# EAGLE design ECE411_G16_V8 (EAGLE 9.2.1)
Version 6: Added bypass capacitors to uC +Vcc, added test points for I2C.
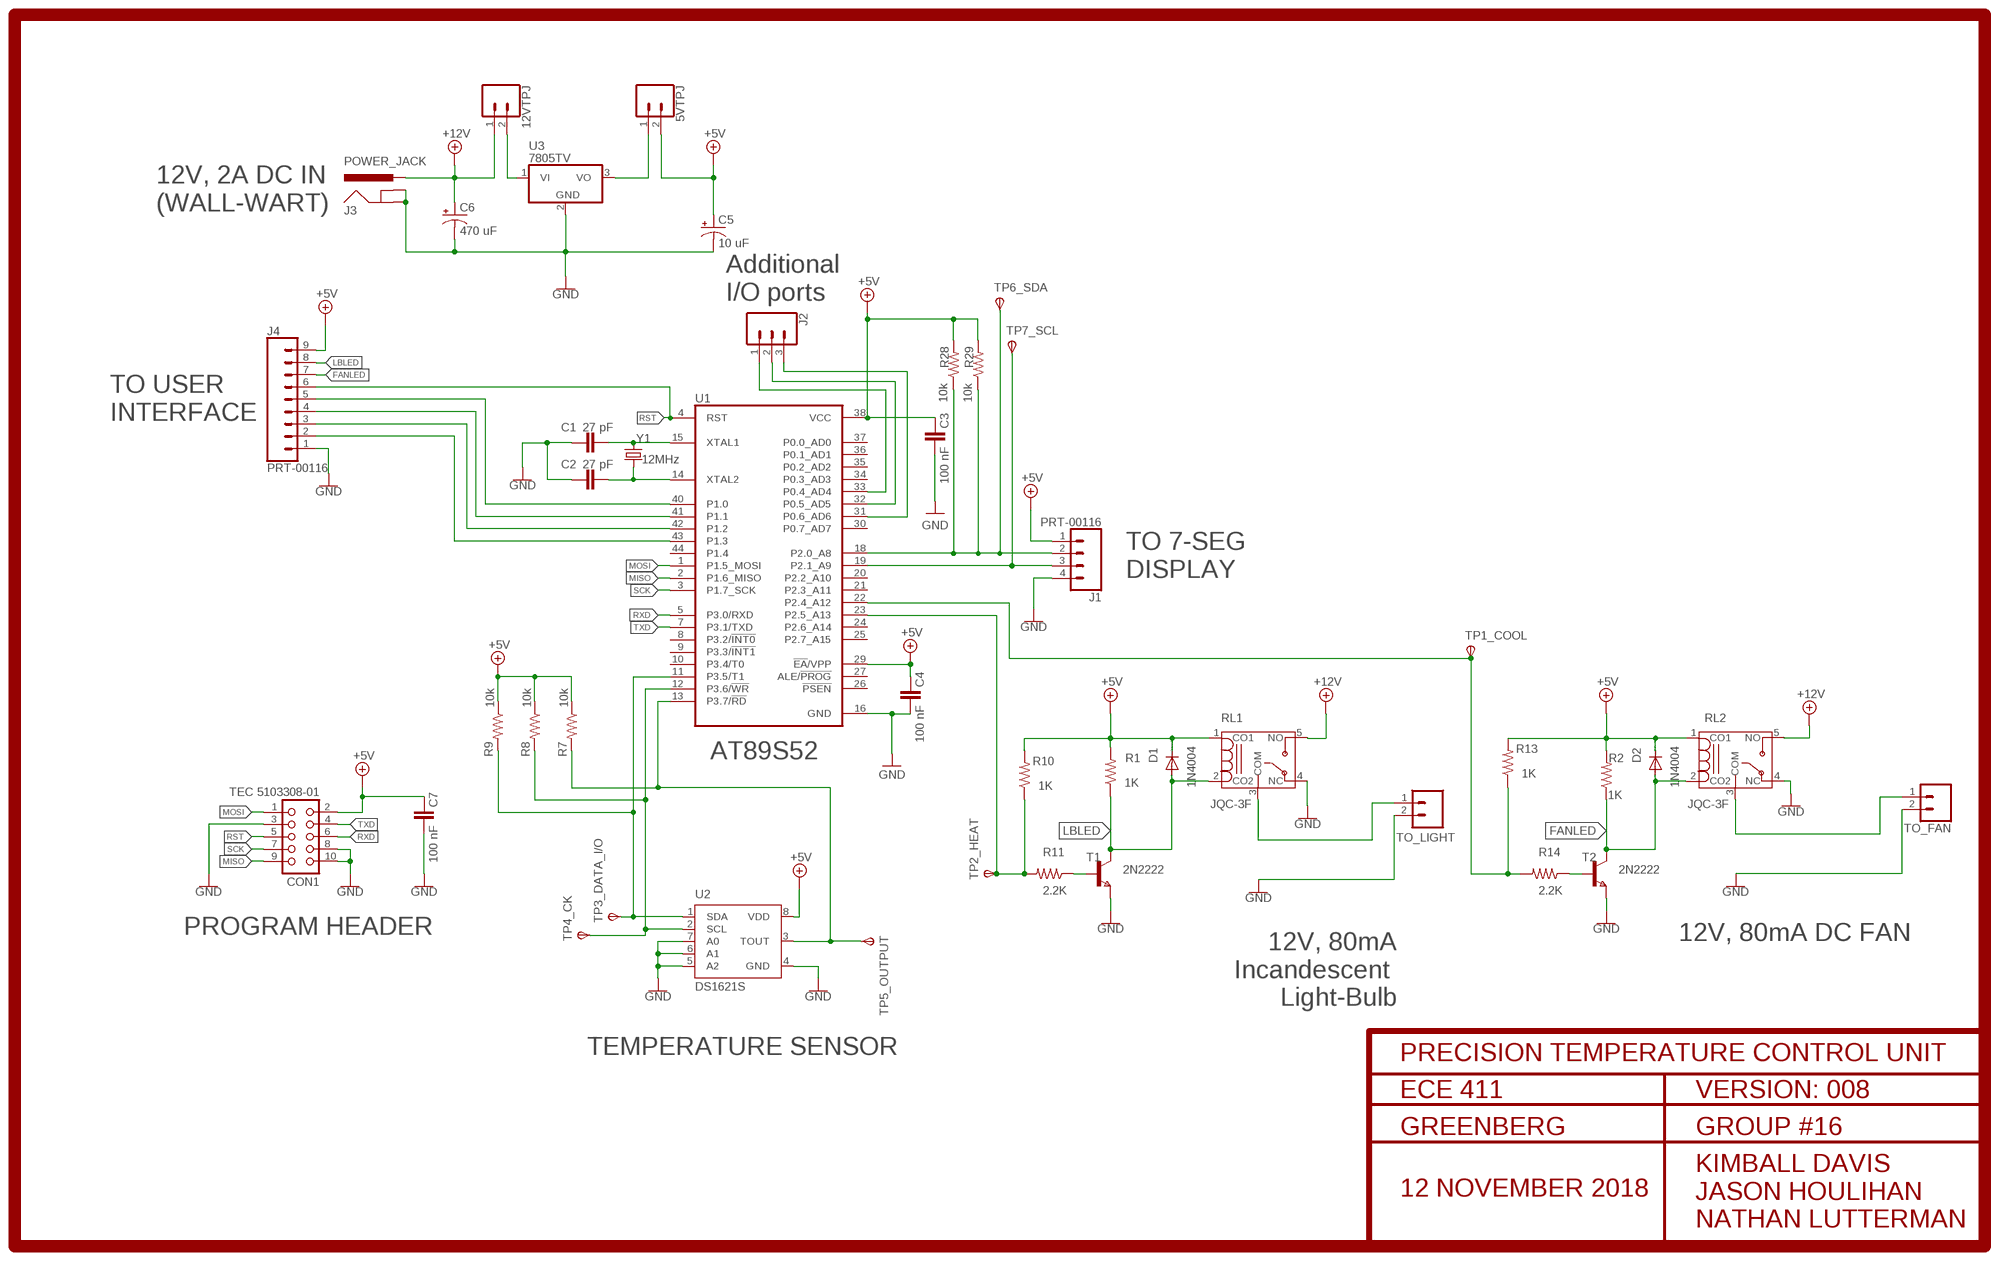
[diagram p0: schematic, sheet 1]

## Parts
5VTPJ  CONN_02  [1X02]
12VTPJ  CONN_02  [1X02]
C1  27 pF  CAPACITOR_0603_M  [RESC0603_M]
C2  27 pF  CAPACITOR_0603_M  [RESC0603_M]
C3  100 nF  CAPACITOR_0603_M  [RESC0603_M]
C4  100 nF  CAPACITOR_0603_M  [RESC0603_M]
C5  10 uF  CPOL-USTT2D6  [TT2D6]
C6  470 uF  CPOL-USTT5D11  [TT5D11]
C7  100 nF  CAPACITOR_0603_M  [RESC0603_M]
CON1  TEC 5103308-01  CON10  [CON10]
D1  1N4004  [DO41-10]
D2  1N4004  [DO41-10]
J1  PRT-00116  CONN_04  [1X04]
J2  CONN_03  [1X03]
J3  POWER_JACK  [POWER_JACK_PTH]
J4  PRT-00116  CONN_09  [1X09]
R1  1K  R-US_R0603  [R0603]
R2  1K  R-US_R0603  [R0603]
R7  10k  R-US_R0603  [R0603]
R8  10k  R-US_R0603  [R0603]
R9  10k  R-US_R0603  [R0603]
R10  1K  R-US_R0603  [R0603]
R11  2.2K  R-US_R0603  [R0603]
R13  1K  R-US_R0603  [R0603]
R14  2.2K  R-US_R0603  [R0603]
R28  10k  R-US_R0603  [R0603]
R29  10k  R-US_R0603  [R0603]
RL1  JQC-3F  [T073]
RL2  JQC-3F  [T073]
T1  2N2222  NPNSOT23  [SOT-23]
T2  2N2222  NPNSOT23  [SOT-23]
TO_FAN  CONN_02  [1X02]
TO_LIGHT  CONN_02  [1X02]
TP1_COOL  TPSTP20SQ  [TP20SQ]
TP2_HEAT  TPSTP20SQ  [TP20SQ]
TP3_DATA_I/O  TPSTP20SQ  [TP20SQ]
TP4_CK  TPSTP20SQ  [TP20SQ]
TP5_OUTPUT  TPSTP20SQ  [TP20SQ]
TP6_SDA  TPSTP20SQ  [TP20SQ]
TP7_SCL  TPSTP20SQ  [TP20SQ]
U1  AT89S52  AT89S51-24P  [TQFP44]
U2  DS1621S  [SO08]
U3  7805TV  [TO220V]
Y1  12MHz  CRYSTAL-12MHZ"  [CRYSTAL-SMD-5X3.2-4PAD]

## Nets
+5V: 5VTPJ.2 C3.2 C4.2 C5.+ C7.2 CON1.2 D1.C D2.C J1.1 J4.9 R1.2 R2.2 R7.1 R8.1 R9.1 R10.2 R13.2 R28.2 R29.2 RL1.1(CO1) RL2.1(CO1) U1.29(!EA!/VPP) U1.38(VCC) U2.8(VDD)
+12V: 12VTPJ.1 C6.+ J3.PWR RL1.5(NO) RL2.5(NO)
FANLED: D2.A J4.7 R2.1 RL2.2(CO2) T2.1(C)
GND: C1.1 C2.1 C3.1 C4.1 C5.- C6.- C7.1 CON1.3 CON1.8 CON1.10 J1.4 J3.GND J3.GNDBREAK J4.1 RL1.4(NC) RL2.4(NC) T1.2(E) T2.2(E) TO_FAN.2 TO_LIGHT.2 U1.16(GND) U2.4(GND) U2.5(A2) U2.6(A1) U2.7(A0) U3.2(GND)
LBLED: D1.A J4.8 R1.1 RL1.2(CO2) T1.1(C)
MISO: CON1.9 U1.2(P1.6_MISO)
MOSI: CON1.1 U1.1(P1.5_MOSI)
N$1: C1.2 U1.15(XTAL1) Y1.1
N$2: C2.2 U1.14(XTAL2) Y1.3
N$3: J1.2 R28.1 R29.1 TP6_SDA.TP(PP) U1.18(P2.0_A8)
N$4: J1.3 TP7_SCL.TP(PP) U1.19(P2.1_A9)
N$5: 12VTPJ.2 U3.1(VI)
N$6: 5VTPJ.1 U3.3(VO)
N$7: RL2.3(COM) TO_FAN.1
N$8: RL1.3(COM) TO_LIGHT.1
N$9: R7.2 TP5_OUTPUT.TP(PP) U1.13(P3.7/!RD) U2.3(TOUT)
N$10: R8.2 TP4_CK.TP(PP) U1.12(P3.6/!WR) U2.2(SCL)
N$11: R9.2 TP3_DATA_I/O.TP(PP) U1.11(P3.5/T1) U2.1(SDA)
N$12: R10.1 R11.2 TP2_HEAT.TP(PP) U1.23(P2.5_A13)
N$13: R11.1 T1.3(B)
N$14: J2.1 U1.33(P0.4_AD4)
N$15: J2.2 U1.32(P0.5_AD5)
N$16: R13.1 R14.2 TP1_COOL.TP(PP) U1.22(P2.4_A12)
N$17: R14.1 T2.3(B)
N$18: J2.3 U1.31(P0.6_AD6)
N$34: J4.5 U1.40(P1.0)
N$35: J4.4 U1.41(P1.1)
N$36: J4.3 U1.42(P1.2)
N$37: J4.2 U1.43(P1.3)
RST: CON1.5 J4.6 U1.4(RST)
RXD: CON1.6 U1.5(P3.0/RXD)
SCK: CON1.7 U1.3(P1.7_SCK)
TXD: CON1.4 U1.7(P3.1/TXD)
Unconnected: U1.8(P3.2/!INT0) U1.9(P3.3/!INT1) U1.10(P3.4/T0) U1.20(P2.2_A10) U1.21(P2.3_A11) U1.24(P2.6_A14) U1.25(P2.7_A15) U1.26(!PSEN) U1.27(ALE/!PROG) U1.30(P0.7_AD7) U1.34(P0.3_AD3) U1.35(P0.2_AD2) U1.36(P0.1_AD1) U1.37(P0.0_AD0) U1.44(P1.4)

## Notes on the sheet
- 12V, 2A DC IN
  (WALL-WART)
- Additional
  I/O ports
- TO USER
  INTERFACE
- TO 7-SEG 
  DISPLAY
- AT89S52
- PROGRAM HEADER | 12V, 80mA DC FAN
- 12V, 80mA
  Incandescent 
  Light-Bulb
- TEMPERATURE SENSOR

## Power pins joined to a net without a drawn wire
GND: U1.17(GND)

## Library data of the parts
5VTPJ 12VTPJ TO_FAN TO_LIGHT = SparkFun-Connectors:CONN_02: Multi connection point. Often used as Generic Header-pin footprint for 0.1 inch spaced/style header connections On any of the 0.1 inch spaced packages, you can populate with these: Break Away Headers - Straight <https://www.sparkfun.com/products/116> (PRT-00116) Break Away Male Headers - Right Angle <https://www.sparkfun.com/products/553> (PRT-00553) Female Headers <https://www.sparkfun.com/products/115> (PRT-00115) Break Away Headers - Machine Pin <https://www.sparkfun.com/products/117> (PRT-00117) Break Away Female Headers - Swiss Machine Pin <https://www.sparkfun.com/products/743> (PRT-00743) For SCREWTERMINALS and SPRING TERMINALS visit here: Screw Terimnals on SparkFun.com <https://www.sparkfun.com/search/results?term=Screw+Terminals> (5mm/3.5mm/2.54mm spacing) This device is also useful as a general connection point to wire up your design to another part of your project. Our various solder wires solder well into these plated through hole pads. Hook-Up Wire - Assortment (Stranded, 22 AWG) <https://www.sparkfun.com/products/11375> (PRT-11375) Hook-Up Wire - Assortment (Solid Core, 22 AWG) <https://www.sparkfun.com/products/11367> (PRT-11367) View the entire wire category on our website here <https://www.sparkfun.com/categories/141> Special notes: Molex polarized connector foot print use with: PRT-08233 with associated crimp pins and housings. 2.54_SCREWTERM for use with PRT-10571. 3.5mm Screw Terminal footprints for PRT-08084 5mm Screw Terminal footprints for use with PRT-08432
C1-C4 C7 = Nordic_nRF:CAPACITOR: Generic chip capacitor
C5 C6 = rcl:CPOL-US: POLARIZED CAPACITOR, American symbol; SPICEPREFIX: C
CON1 = con-harting:CON10: CONNECTOR; OC_FARNELL: unknown; OC_NEWARK: unknown
D1 D2 = diode:1N4004: DIODE general purpose rectifier, 1 A
J1 = SparkFun-Connectors:CONN_04: Multi connection point. Often used as Generic Header-pin footprint for 0.1 inch spaced/style header connections On any of the 0.1 inch spaced packages, you can populate with these: Break Away Headers - Straight <https://www.sparkfun.com/products/116> (PRT-00116) Break Away Male Headers - Right Angle <https://www.sparkfun.com/products/553> (PRT-00553) Female Headers <https://www.sparkfun.com/products/115> (PRT-00115) Break Away Headers - Machine Pin <https://www.sparkfun.com/products/117> (PRT-00117) Break Away Female Headers - Swiss Machine Pin <https://www.sparkfun.com/products/743> (PRT-00743) For SCREWTERMINALS and SPRING TERMINALS visit here: Screw Terimnals on SparkFun.com <https://www.sparkfun.com/search/results?term=Screw+Terminals> (5mm/3.5mm/2.54mm spacing) This device is also useful as a general connection point to wire up your design to another part of your project. Our various solder wires solder well into these plated through hole pads. Hook-Up Wire - Assortment (Stranded, 22 AWG) <https://www.sparkfun.com/products/11375> (PRT-11375) Hook-Up Wire - Assortment (Solid Core, 22 AWG) <https://www.sparkfun.com/products/11367> (PRT-11367) View the entire wire category on our website here <https://www.sparkfun.com/categories/141> Special notes: Molex polarized connector foot print use with SKU : PRT-08231 with associated crimp pins and housings. 1MM SMD Version SKU: PRT-10208; PROD_ID: CONN-09696
J2 = SparkFun-Connectors:CONN_03: Multi connection point. Often used as Generic Header-pin footprint for 0.1 inch spaced/style header connections On any of the 0.1 inch spaced packages, you can populate with these: Break Away Headers - Straight <https://www.sparkfun.com/products/116> (PRT-00116) Break Away Male Headers - Right Angle <https://www.sparkfun.com/products/553> (PRT-00553) Female Headers <https://www.sparkfun.com/products/115> (PRT-00115) Break Away Headers - Machine Pin <https://www.sparkfun.com/products/117> (PRT-00117) Break Away Female Headers - Swiss Machine Pin <https://www.sparkfun.com/products/743> (PRT-00743) Stackable Header - 3 Pin (Female, 0.1") <https://www.sparkfun.com/products/13875> (PRT-13875) For SCREWTERMINALS and SPRING TERMINALS visit here: Screw Terimnals on SparkFun.com <https://www.sparkfun.com/search/results?term=Screw+Terminals> (5mm/3.5mm/2.54mm spacing) This device is also useful as a general connection point to wire up your design to another part of your project. Our various solder wires solder well into these plated through hole pads. Hook-Up Wire - Assortment (Stranded, 22 AWG) <https://www.sparkfun.com/products/11375> (PRT-11375) Hook-Up Wire - Assortment (Solid Core, 22 AWG) <https://www.sparkfun.com/products/11367> (PRT-11367) View the entire wire category on our website here <https://www.sparkfun.com/categories/141> Special notes: Molex polarized connector foot print use with SKU : PRT-08232 with associated crimp pins and housings.
J3 = SparkFun-Connectors:POWER_JACK: Power Jack Connector This is the standard 5.5mm barrel jack for power. The PTH is the most common, proven, reliable, footprint. The Slot footprint only works if the mill layer is transmitted to the PCB fab house so be warned. Here are the connectors we sell at SparkFun: DC Barrel Power Jack/Connector <https://www.sparkfun.com/products/119> (PRT-00119) DC Barrel Power Jack/Connector (SMD) <https://www.sparkfun.com/products/12748> (PRT-12748) DC Barrel Jack Adapter - Breadboard Compatible <https://www.sparkfun.com/products/10811> (PRT-10811) It is used on this SparkFun product (and many, many others): SparkFun RedBoard - Programmed with Arduino <https://www.sparkfun.com/products/12757> (DEV-12757) Also, if you need a mating power supply or connector, please check these out: Wall Adapter Power Supply - 9VDC 650mA <https://www.sparkfun.com/products/298> (TOL-00298) DC Barrel Jack Adapter - Male <https://www.sparkfun.com/products/10287> (PRT-10287); PROD_ID: CONN-08197
J4 = SparkFun-Connectors:CONN_09: Multi connection point. Often used as Generic Header-pin footprint for 0.1 inch spaced/style header connections On any of the 0.1 inch spaced packages, you can populate with these: Break Away Headers - Straight <https://www.sparkfun.com/products/116> (PRT-00116) Break Away Male Headers - Right Angle <https://www.sparkfun.com/products/553> (PRT-00553) Female Headers <https://www.sparkfun.com/products/115> (PRT-00115) Break Away Headers - Machine Pin <https://www.sparkfun.com/products/117> (PRT-00117) Break Away Female Headers - Swiss Machine Pin <https://www.sparkfun.com/products/743> (PRT-00743) For SCREWTERMINALS and SPRING TERMINALS visit here: Screw Terimnals on SparkFun.com <https://www.sparkfun.com/search/results?term=Screw+Terminals> (5mm/3.5mm/2.54mm spacing) This device is also useful as a general connection point to wire up your design to another part of your project. Our various solder wires solder well into these plated through hole pads. Hook-Up Wire - Assortment (Stranded, 22 AWG) <https://www.sparkfun.com/products/11375> (PRT-11375) Hook-Up Wire - Assortment (Solid Core, 22 AWG) <https://www.sparkfun.com/products/11367> (PRT-11367) View the entire wire category on our website here <https://www.sparkfun.com/categories/141> Special notes: Molex polarized connector foot print use with SKU : PRT-08231 with associated crimp pins and housings. 1MM SMD Version SKU: PRT-10208 NOTES ON THE VARIANTS LOCK and LOCK_LONGPADS... This footprint was designed to help hold the alignment of a through-hole component (i.e. 6-pin header) while soldering it into place. You may notice that each hole has been shifted either up or down by 0.005 of an inch from it's more standard position (which is a perfectly straight line). This slight alteration caused the pins (the squares in the middle) to touch the edges of the holes. Because they are alternating, it causes a "brace" to hold the component in place. 0.005 has proven to be the perfect amount of "off-center" position when using our standard breakaway headers. Although looks a little odd when you look at the bare footprint, once you have a header in there, the alteration is very hard to notice. Also,if you push a header all the way into place, it is covered up entirely on the bottom side.
R1 R2 R7-R11 R13 R14 R28 R29 = audio amplifier example:R-US_: RESISTOR, American symbol
RL1 RL2 = JQC-3F:JQC-3F
T1 T2 = zetex:NPNSOT23: NPN TRANSISTOR; MPN: DSS20201L-7; OC_FARNELL: 1710688; OC_NEWARK: 25R4555
TP1_COOL TP2_HEAT TP3_DATA_I/O TP4_CK TP5_OUTPUT TP6_SDA TP7_SCL = testpad:TPS: TEST PIN
U1 = atmel:AT89S51*P: 8-bit Microcontroller with 4K BytesIn-System Programmable Flash Source: http://www.atmel.com/dyn/resources/prod_documents/doc2487.pdf; OC_FARNELL: unknown; OC_NEWARK: unknown
U2 = maxim:DS1621: Digital Thermometer and Thermostat Source: http://pdfserv.maxim-ic.com/en/ds/DS1621.pdf; MF: DALLAS SEMICONDUCTOR; MPN: DS1621S+; OC_FARNELL: 9725261; OC_NEWARK: 23K3501
U3 = linear:78*: Positive VOLTAGE REGULATOR Source: http://cache.national.com/ds/LM/LM78L05.pdf http://www.fairchildsemi.com/ds/LM/LM7805.pdf
Y1 = SparkFun-Clocks:CRYSTAL-12MHZ: 12.0MHz Crystal Frequency: 12.0MHz Frequency Tolerance: ±20ppm Load Capacitance: 18pF SparkFun Products: SparkFun Logomatic <https://www.sparkfun.com/products/12772> Pocket AVR Programmer <https://www.sparkfun.com/products/9825>; PROD_ID: XTAL-08297

## Board
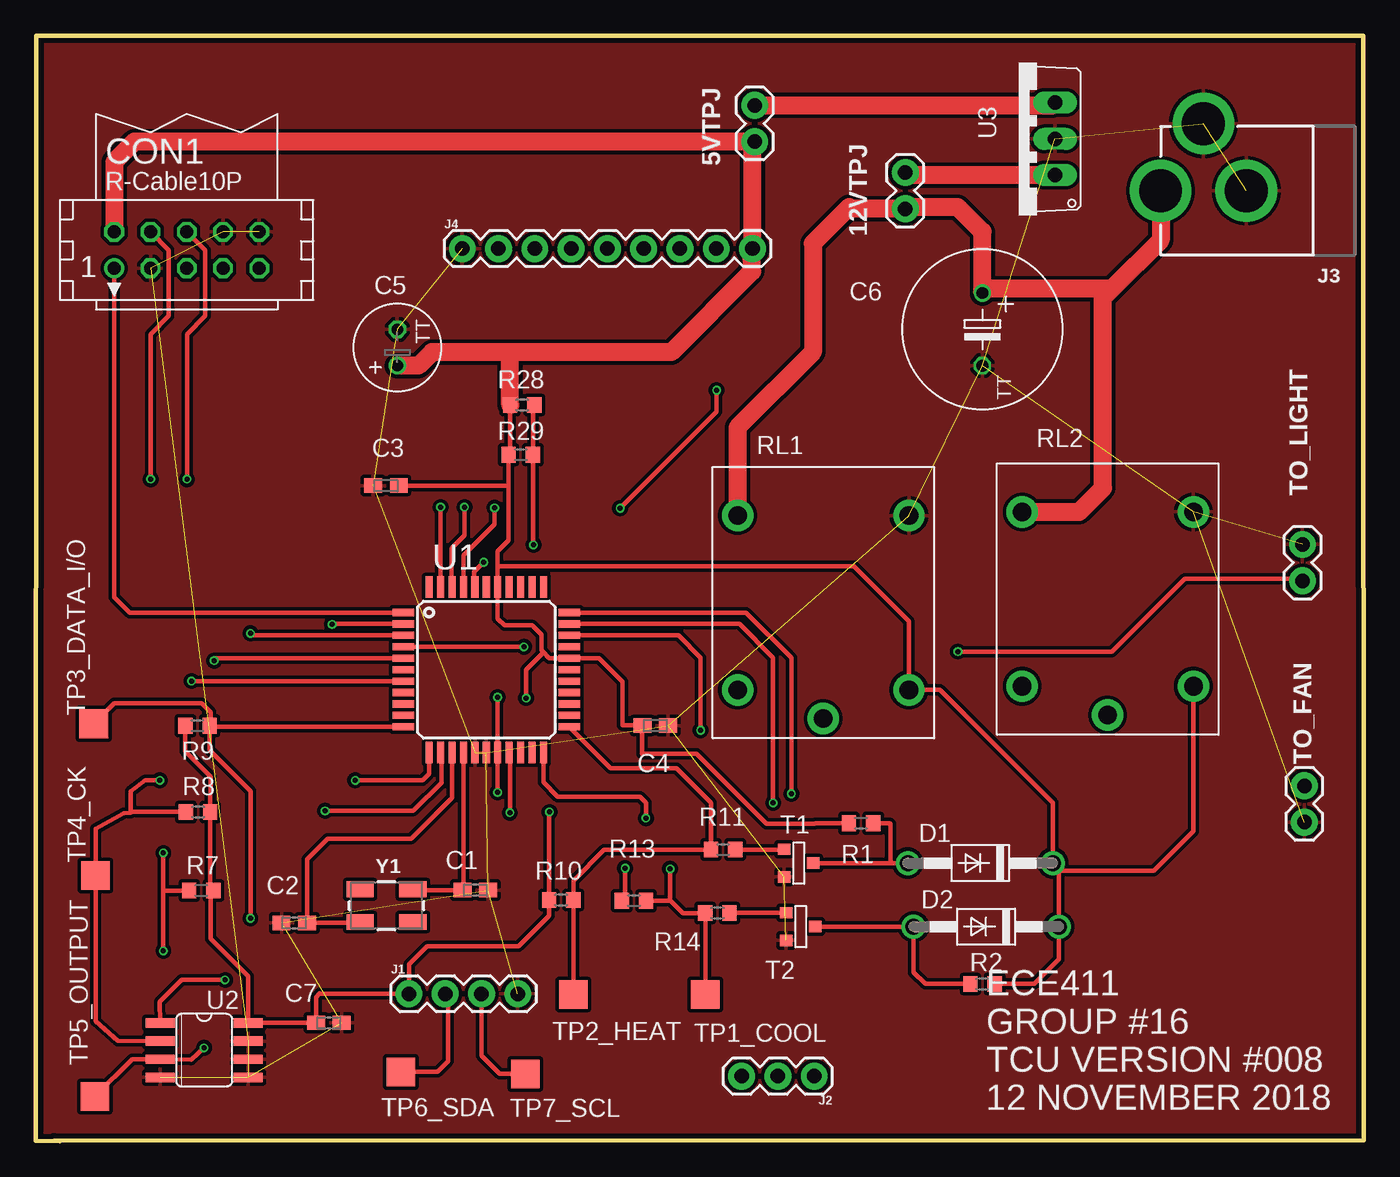
[diagram p1: board, top side]
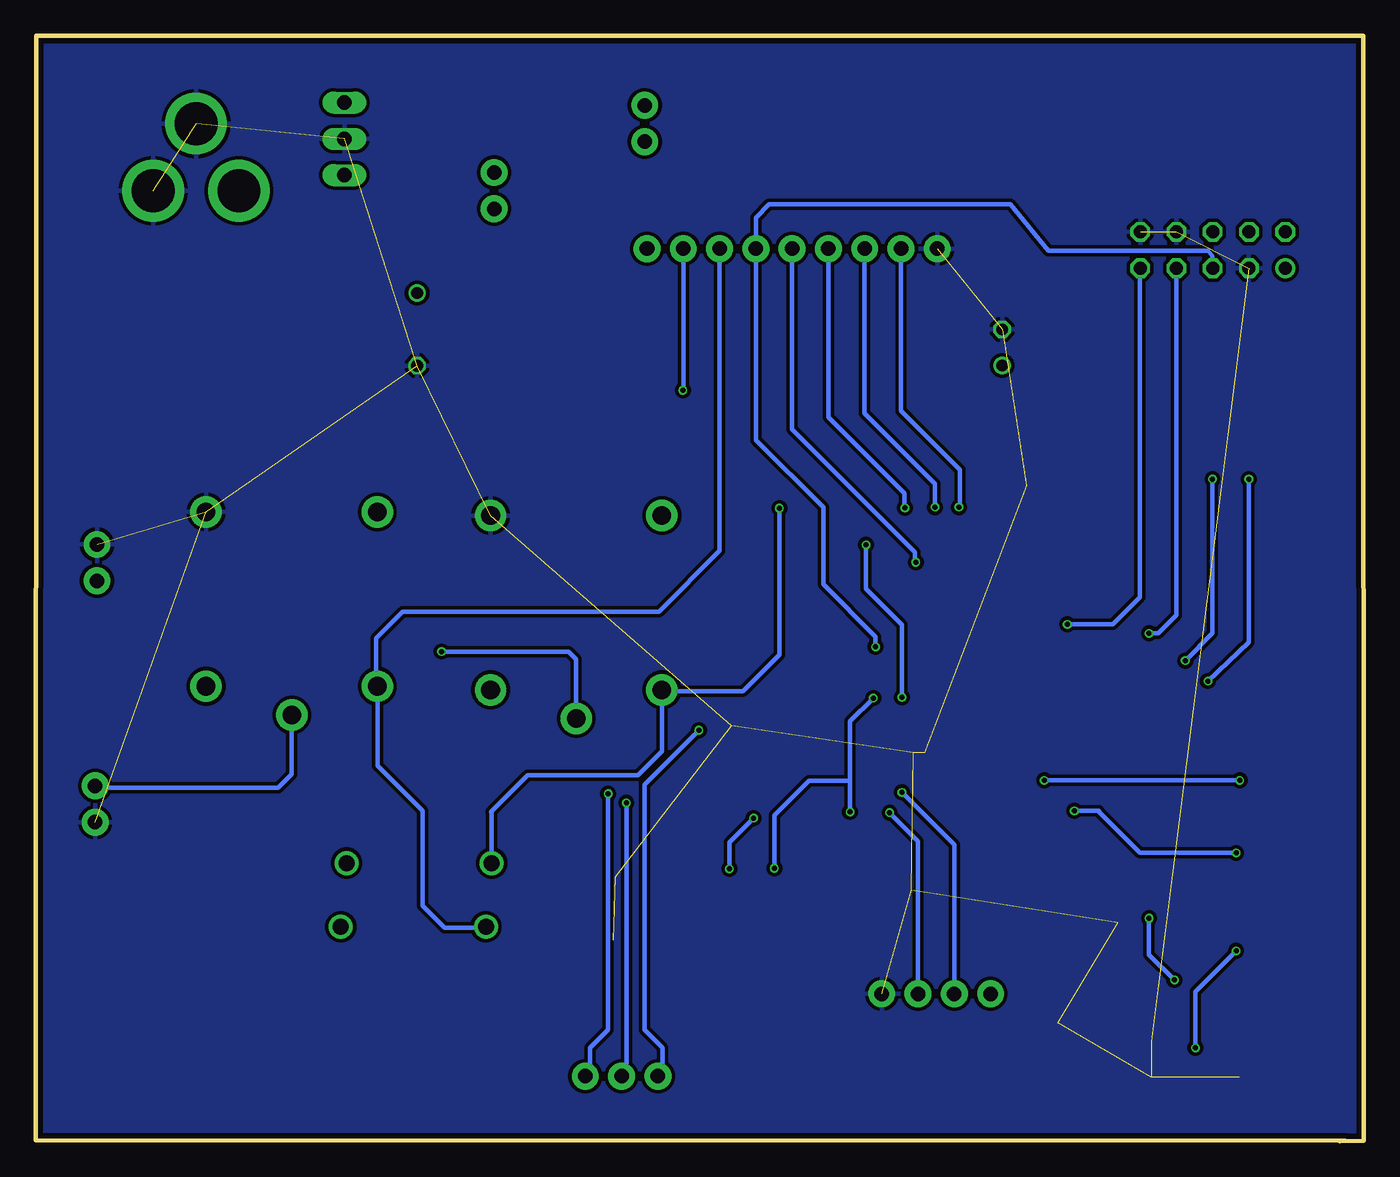
[diagram p2: board, bottom side, seen from below]

Size 92.99 x 77.37 mm. Coordinates in mm from the lower left corner, seen from the top.
Outline: 1.3,0.03 92.99,0.05 92.96,77.37 0.05,77.37 0,0.03 1.68,0
Copper layers (1*16): Top 0.035559375mm / dielectric 1.6mm / Bottom 0.035559375mm
Design rules "2LAYER": minimum track width 6mil, minimum drill 10mil, track to track 6mil, track to pad 6mil, pad to pad 6mil, via to via 6mil, smd to smd 6mil, copper to edge 15mil, drill to drill 6mil, minimum pad ring 5mil, minimum via ring 5mil, stop-mask expansion 2.5mil, vias tented up to drill 0mil, thermal gap 10mil

### Footprints (pad centres in the part's own frame; a part is rotated, then mirrored left to right if it is on the bottom)
1X02 = drill 1.016 pad 1.88: 1 0,0; 2 2.54,0
RESC0603_M = smd 1.25 x 1: 1 -0.9,0; 2 0.9,0
TT2D6 = drill 0.813: + -1.27,0 | drill 0.813 octagon: - 1.27,0
TT5D11 = drill 0.813: + -2.54,0 | drill 0.813 octagon: - 2.54,0
CON10 = drill 0.914: 1 -5.08,-1.27 | drill 0.914 octagon: 2 -5.08,1.27; 3 -2.54,-1.27; 4 -2.54,1.27; 5 0,-1.27; 6 0,1.27; 7 2.54,-1.27; 8 2.54,1.27; 9 5.08,-1.27; 10 5.08,1.27
DO41-10 = drill 1.118: A 5.08,0; C -5.08,0
1X04 = drill 1.016 pad 1.88: 1 0,0; 2 2.54,0; 3 5.08,0; 4 7.62,0
1X03 = drill 1.016 pad 1.88: 1 0,0; 2 2.54,0; 3 5.08,0
POWER_JACK_PTH = drill 2.997 pad 4.318: GND 0,7.7; GNDBREAK 4.7,10.7; PWR 0,13.7
1X09 = drill 1.016 pad 1.88: 1 0,0; 2 2.54,0; 3 5.08,0; 4 7.62,0; 5 10.16,0; 6 12.7,0; 7 15.24,0; 8 17.78,0; 9 20.32,0
R0603 = smd 1 x 1.1: 1 -0.85,0; 2 0.85,0
T073 = drill 1.3 pad 2.2: 1 6.1,6; 2 6.1,-6; 3 8.1,0; 4 -6.1,6; 5 -6.1,-6
SOT-23 = smd 0.787 x 0.889: 1 0.025,-1.016; 2 -0.94,1.016; 3 0.991,1.016
TP20SQ = smd 2 x 2: TP 0,0
TQFP44 = smd 1.5 x 0.5: 1 -5.8,4; 2 -5.8,3.2; 3 -5.8,2.4; 4 -5.8,1.6; 5 -5.8,0.8; 6 -5.8,0; 7 -5.8,-0.8; 8 -5.8,-1.6; 9 -5.8,-2.4; 10 -5.8,-3.2; 11 -5.8,-4; 23 5.8,-4; 24 5.8,-3.2; 25 5.8,-2.4; 26 5.8,-1.6; 27 5.8,-0.8; 28 5.8,0; 29 5.8,0.8; 30 5.8,1.6; 31 5.8,2.4; 32 5.8,3.2; 33 5.8,4 | smd 0.5 x 1.5: 12 -4,-5.8; 13 -3.2,-5.8; 14 -2.4,-5.8; 15 -1.6,-5.8; 16 -0.8,-5.8; 17 0,-5.8; 18 0.8,-5.8; 19 1.6,-5.8; 20 2.4,-5.8; 21 3.2,-5.8; 22 4,-5.8; 34 4,5.8; 35 3.2,5.8; 36 2.4,5.8; 37 1.6,5.8; 38 0.8,5.8; 39 0,5.8; 40 -0.8,5.8; 41 -1.6,5.8; 42 -2.4,5.8; 43 -3.2,5.8; 44 -4,5.8
SO08 = smd 0.66 x 2.032: 1 -1.905,-3.073; 2 -0.635,-3.073; 3 0.635,-3.073; 4 1.905,-3.073; 5 1.905,3.073; 6 0.635,3.073; 7 -0.635,3.073; 8 -1.905,3.073
TO220V = drill 1.016 long: 1 -2.54,-2.54; 2 0,-2.54; 3 2.54,-2.54
CRYSTAL-SMD-5X3.2-4PAD = smd 1.9 x 1.1: 1 -1.85,-1.15; 2 1.85,-1.15; 3 1.85,1.15; 4 -1.85,1.15

### Placement (x,y rotation side)
5VTPJ  50.34,72.49 270 top
12VTPJ  60.88,65.25 90 top
C1  30.78,17.57 180 top
C2  18.11,15.27 0 top
C3  24.52,45.88 0 top
C4  43.38,29.08 180 top
C5  25.32,55.55 90 top
C6  66.29,56.81 270 top
C7  20.52,8.28 180 top
CON1  10.58,62.36 0 top
D1  66.14,19.46 180 top
D2  66.55,15.01 180 top
J1  26.13,10.31 0 top
J2  54.51,4.55 180 top
J3  92.46,66.52 90 top
J4  29.87,62.47 0 top
R1  57.79,22.25 180 top
R2  66.29,11 0 top
R7  11.6,17.54 180 top
R8  11.37,23.04 180 top
R9  11.33,29.08 0 top
R10  36.79,16.88 180 top
R11  48.14,20.4 180 top
R13  41.88,16.83 180 top
R14  47.73,15.97 180 top
R28  34.07,51.52 180 top
R29  33.96,48.04 180 top
RL1  55.14,37.68 270 top
RL2  75.06,37.93 270 top
T1  53.42,19.43 90 top
T2  53.56,14.99 90 top
TO_FAN  88.82,24.87 270 top
TO_LIGHT  88.7,39.22 90 top
TP1_COOL  46.88,10.26 0 top
TP2_HEAT  37.65,10.26 0 top
TP3_DATA_I/O  4.06,29.21 180 top
TP4_CK  4.2,18.58 180 top
TP5_OUTPUT  4.13,3.12 0 top
TP6_SDA  25.58,4.85 0 top
TP7_SCL  34.29,4.7 0 top
U1  31.55,32.99 0 top
U2  11.79,6.36 270 top
U3  68.83,70.15 90 top
Y1  24.56,16.48 180 top

### Tracks (layer width: path | path; a pad name or v marks a point on that pad's centre or on a via)
+5V  (via drill 0.35)
  Top 0.305: 33.11,45.95 R29.2 33.22,48.14 R28.2 | 33.11,45.95 33.11,42.05 32.33,41.27 32.33,40.23 | 32.33,40.23 U1.38 32.35,36.56 32.82,36.09 34.75,36.09 35.41,35.43 35.41,34.34 35.55,34.2 | 32.33,40.23 57.3,40.23 61.14,36.39 RL1.1 61.16,31.6 63.3,31.6 71.22,23.68 D1.C | 35.55,34.2 35.95,33.79 U1.29 39.43,33.79 41.07,32.16 41.07,29.11 42.46,29.11 C4.2 42.47,29.07 42.47,27.13 46.28,27.13 46.28,27.1 51.16,22.22 54.56,22.22 54.58,22.25 R1.2 | v35.97,23.04 35.94,23.01 R10.2 35.94,15.78 33.81,13.64 27.41,13.64 26.13,12.36 J1.1 19.92,10.31 19.89,10.34 19.62,10.07 C7.2 U2.8 14.87,11.55 12.27,14.15 12.27,17.35 R7.1 12.22,17.55 R8.1 12.24,25.5 10.47,27.28 R9.1 | v34.34,31.01 34.34,32.99 35.55,34.2 | v41.28,19.1 41.28,17.07 R13.2 | D1.C 71.63,19.46 D2.C 71.65,14.98 71.65,12.73 69.93,11 R2.2 | RL2.1 81.06,21.7 78.28,18.92 71.75,18.92 D1.C | C3.2 33.05,45.88 33.11,45.95
  Top 1.27: 50.15,60.87 44.5,55.22 32.82,55.22 | 50.15,60.87 50.06,60.96 | 32.82,55.22 27.74,55.22 26.79,54.28 C5.+ | R28.2 33.22,54.82 32.82,55.22 | CON1.2 5.5,68.54 6.91,69.95 5VTPJ.2 50.19,69.8 J4.9 50.13,62.41 50.15,60.87
  Bottom 0.305: v35.97,23.04 35.97,25.22 | 35.97,25.22 35.97,29.39 v34.34,31.01 | 35.97,25.22 38.86,25.22 41.28,22.81 v41.28,19.1
+12V
  Top 1.27: RL1.5 49.14,49.95 54.41,55.22 54.41,62.84 56.95,65.38 57.07,65.25 12VTPJ.1 61.01,65.38 64.57,65.38 66.29,63.66 C6.+ 66.6,59.66 75.36,59.66 | J3.PWR 78.76,63.06 75.36,59.66 | RL2.5 73.07,44.03 74.73,45.69 74.73,59.03 75.36,59.66
FANLED
  Top 0.305: T2.1 D2.A 61.47,11.81 62.28,11 R2.1
  Bottom 0.305: J4.7 45.11,41.3 49.35,37.06 67.28,37.06 69.14,35.2 69.14,31.92 RL2.2 69.06,26.28 65.89,23.11 65.89,16.46 64.36,14.93 61.29,14.93 61.24,14.99 61.44,14.99 D2.A
GND  (26 unrouted)
  pour Bottom (isolate 0.254): -3.64,78.39 -3.64,-2.17 93.8,-2.17 93.8,78.39
  pour Top (isolate 0.254): -1.91,-1.68 93.57,-1.68 93.57,77.75 -1.91,77.75
LBLED  (via drill 0.35)
  Top 0.305: v47.68,52.55 47.68,51.05 v40.92,44.3 | D1.A 59.97,19.46 | T1.1 59.97,19.46 | R1.1 59.82,22.25 59.84,22.22 59.84,19.58 59.97,19.46
  Bottom 0.305: J4.8 47.65,52.58 v47.68,52.55 | v40.92,44.3 40.92,34.04 43.46,31.5 49.05,31.5 49.08,31.52 | 49.08,31.52 RL1.2 | D1.A 61.06,22.98 61.11,23.04 58.55,25.6 50.8,25.6 49.12,27.28 49.12,31.47 49.08,31.52
MISO  (via drill 0.35)
  Top 0.305: U1.2 20.78,36.19 v20.75,36.17
  Bottom 0.305: v20.75,36.17 17.58,36.17 15.67,38.07 15.67,61.08 CON1.9
MOSI
  Top 0.305: U1.1 6.59,36.99 5.51,38.07 5.51,61.08 CON1.1
N$1
  Top 0.305: Y1.1 26.48,17.57 C1.2 29.95,17.63 U1.15
N$2
  Top 0.305: Y1.3 22.65,15.27 C2.2 19.01,19.72 20.45,21.16 26.29,21.16 29.15,24.02 U1.14
N$3  (via drill 0.35)
  Top 0.305: v34.85,41.73 34.81,41.77 R29.1 34.81,51.52 R28.1 | v32.33,31.06 U1.18 | U1.18 | v32.33,24.41 U1.18 | TP6_SDA.TP 28.14,4.85 28.88,5.59 28.88,10.1 J1.2
  Bottom 0.305: v34.85,41.73 34.85,38.66 32.33,36.14 v32.33,31.06 | J1.2 28.67,20.75 v32.33,24.41
N$4  (via drill 0.35)
  Top 0.305: v33.2,22.99 33.2,27.14 U1.19 | TP7_SCL.TP 32.49,4.7 31.22,5.97 J1.3
  Bottom 0.305: J1.3 31.21,21 v33.2,22.99
N$5
  Top 1.27: U3.1 61.07,67.6 12VTPJ.2
N$6
  Top 1.27: 5VTPJ.1 71.17,72.49 U3.3
N$7
  Bottom 0.305: RL2.3 75.06,25.68 76,24.74 88.7,24.74 TO_FAN.1
N$8  (via drill 0.35)
  Top 0.305: TO_LIGHT.1 88.57,39.34 80.44,39.34 75.36,34.26 v64.57,34.26
  Bottom 0.305: RL1.3 55.14,33.73 55.68,34.26 v64.57,34.26
N$9  (via drill 0.35)
  Top 0.305: U2.3 8.61,5.73 | 8.61,5.73 6.74,5.73 TP5_OUTPUT.TP | v20.27,23.11 26.44,23.11 28.42,25.09 28.42,27.12 U1.13 | v8.94,20.17 8.94,17.54 | 8.94,17.54 v8.94,13.31 | R7.2 9.02,17.54 8.94,17.54 | v11.79,6.53 10.87,5.69 8.61,5.73
  Bottom 0.305: v20.27,23.11 18.55,23.11 18.54,23.04 15.67,20.17 v8.94,20.17 | v8.94,13.31 11.81,10.44 11.81,7.9 | 11.81,7.9 11.81,7.67 | 11.81,7.9 v11.79,6.53
N$10  (via drill 0.35)
  Top 0.305: U1.12 27.55,25.72 27.08,25.25 v22.38,25.25 | 8.67,7.05 U2.2 5.74,7.04 4.19,8.38 TP4_CK.TP 4.2,21.85 6.15,22.96 6.65,22.97 6.65,23.04 | 10.49,23 R8.2 6.65,23.04 | v8.69,25.25 7.67,25.25 6.66,24.49 6.65,23.04
  Bottom 0.305: v22.38,25.25 v8.69,25.25
N$11  (via drill 0.35)
  Top 0.305: U1.11 12.26,28.99 | 12.26,28.99 | 12.26,28.99 R9.2 12.18,27.34 15.04,24.49 v15.04,15.6 | v13.26,11.28 10.21,11.28 8.69,9.75 U2.1 | TP3_DATA_I/O.TP 5.51,30.66 11.63,30.66 12.27,30.02 12.27,29 12.26,28.99
  Bottom 0.305: v15.04,15.6 15.04,13.06 v13.26,11.28
N$12
  Top 0.305: TP2_HEAT.TP R10.1 37.64,18.24 39.81,20.4 R11.2 47.29,23.68 44.88,26.09 40.26,26.09 U1.23
N$13
  Top 0.305: R11.1 52.39,20.4 T1.3
N$14  (via drill 0.35)
  Top 0.305: U1.33 49.75,36.99 52.91,33.83 v52.91,24.31
  Bottom 0.305: v52.91,24.31 52.91,7.8 54.18,6.53 54.18,4.88 J2.1
N$15  (via drill 0.35)
  Top 0.305: U1.32 49.28,36.19 51.64,33.83 v51.64,23.67
  Bottom 0.305: v51.64,23.67 51.64,4.88 J2.2
N$16  (via drill 0.35)
  Top 0.305: TP1_COOL.TP R14.2 46.87,15.95 45.34,15.95 44.46,16.83 | R13.1 44.46,16.83 | U1.22 35.55,25.11 36.55,24.1 42.32,24.1 42.72,23.7 v42.72,22.61 | v44.42,19.05 44.42,16.87 44.46,16.83
  Bottom 0.305: v42.72,22.61 44.42,20.9 v44.42,19.05
N$17
  Top 0.305: R14.1 52.53,15.97 T2.3
N$18  (via drill 0.35)
  Top 0.305: U1.31 45,35.39 46.56,33.83 v46.56,28.75
  Bottom 0.305: v46.56,28.75 50.37,24.94 50.37,7.8 49.1,6.53 49.1,4.88 J2.3
N$34  (via drill 0.35)
  Top 0.305: v31.37,40.51 30.71,39.85 30.71,38.83 U1.40
  Bottom 0.305: J4.5 40.03,50.65 40.03,49.83 31.42,41.22 31.42,40.56 v31.37,40.51
N$35  (via drill 0.35)
  Top 0.305: v32.13,44.32 32.13,43.18 29.95,41 U1.41
  Bottom 0.305: J4.4 37.49,50.67 32.16,45.34 32.16,44.32 v32.13,44.32
N$36  (via drill 0.35)
  Top 0.305: v30.02,44.37 30.02,42.42 29.11,41.5 29.11,38.83 U1.42
  Bottom 0.305: J4.3 34.95,50.95 30.02,46.02 v30.02,44.37
N$37  (via drill 0.35)
  Top 0.305: v28.35,44.37 U1.43
  Bottom 0.305: J4.2 32.41,51.13 28.27,46.99 28.27,44.63 28.4,44.5 28.4,44.42 v28.35,44.37
RST  (via drill 0.35)
  Top 0.305: v34.19,34.59 U1.4 | U1.4
  Bottom 0.305: v34.19,34.59 34.19,35.31 37.85,38.96 37.85,44.35 42.57,49.07 J4.6 42.57,64.62 41.63,65.56 24.74,65.56 22.1,62.31 10.9,62.31 10.59,61.92 CON1.5
RXD  (via drill 0.35)
  Top 0.305: U1.5 12.64,33.79 12.55,33.71 12.55,33.68 v12.5,33.63 | CON1.6 11.86,62.35 11.86,57.76 10.59,56.49 v10.59,46.33
  Bottom 0.305: v10.59,46.33 10.59,35.53 v12.5,33.63
SCK  (via drill 0.35)
  Top 0.305: U1.3 15.22,35.39 15.14,35.48 15.09,35.48 v15.04,35.53
  Bottom 0.305: v15.04,35.53 14.4,35.53 13.13,36.8 13.13,61.08 CON1.7
TXD  (via drill 0.35)
  Top 0.305: CON1.4 9.32,62.35 9.32,57.76 8.05,56.49 v8.05,46.33 | U1.7 v10.91,32.2
  Bottom 0.305: v8.05,46.33 8.05,34.9 v10.91,32.2

### Text on the board
tPlace: ECE411 / GROUP #16 / TCU VERSION #008 / 12 NOVEMBER 2018
Notes: ADD I/O